# EAGLE design corex (EAGLE 6.6.0)

## Sheet 1 of 3
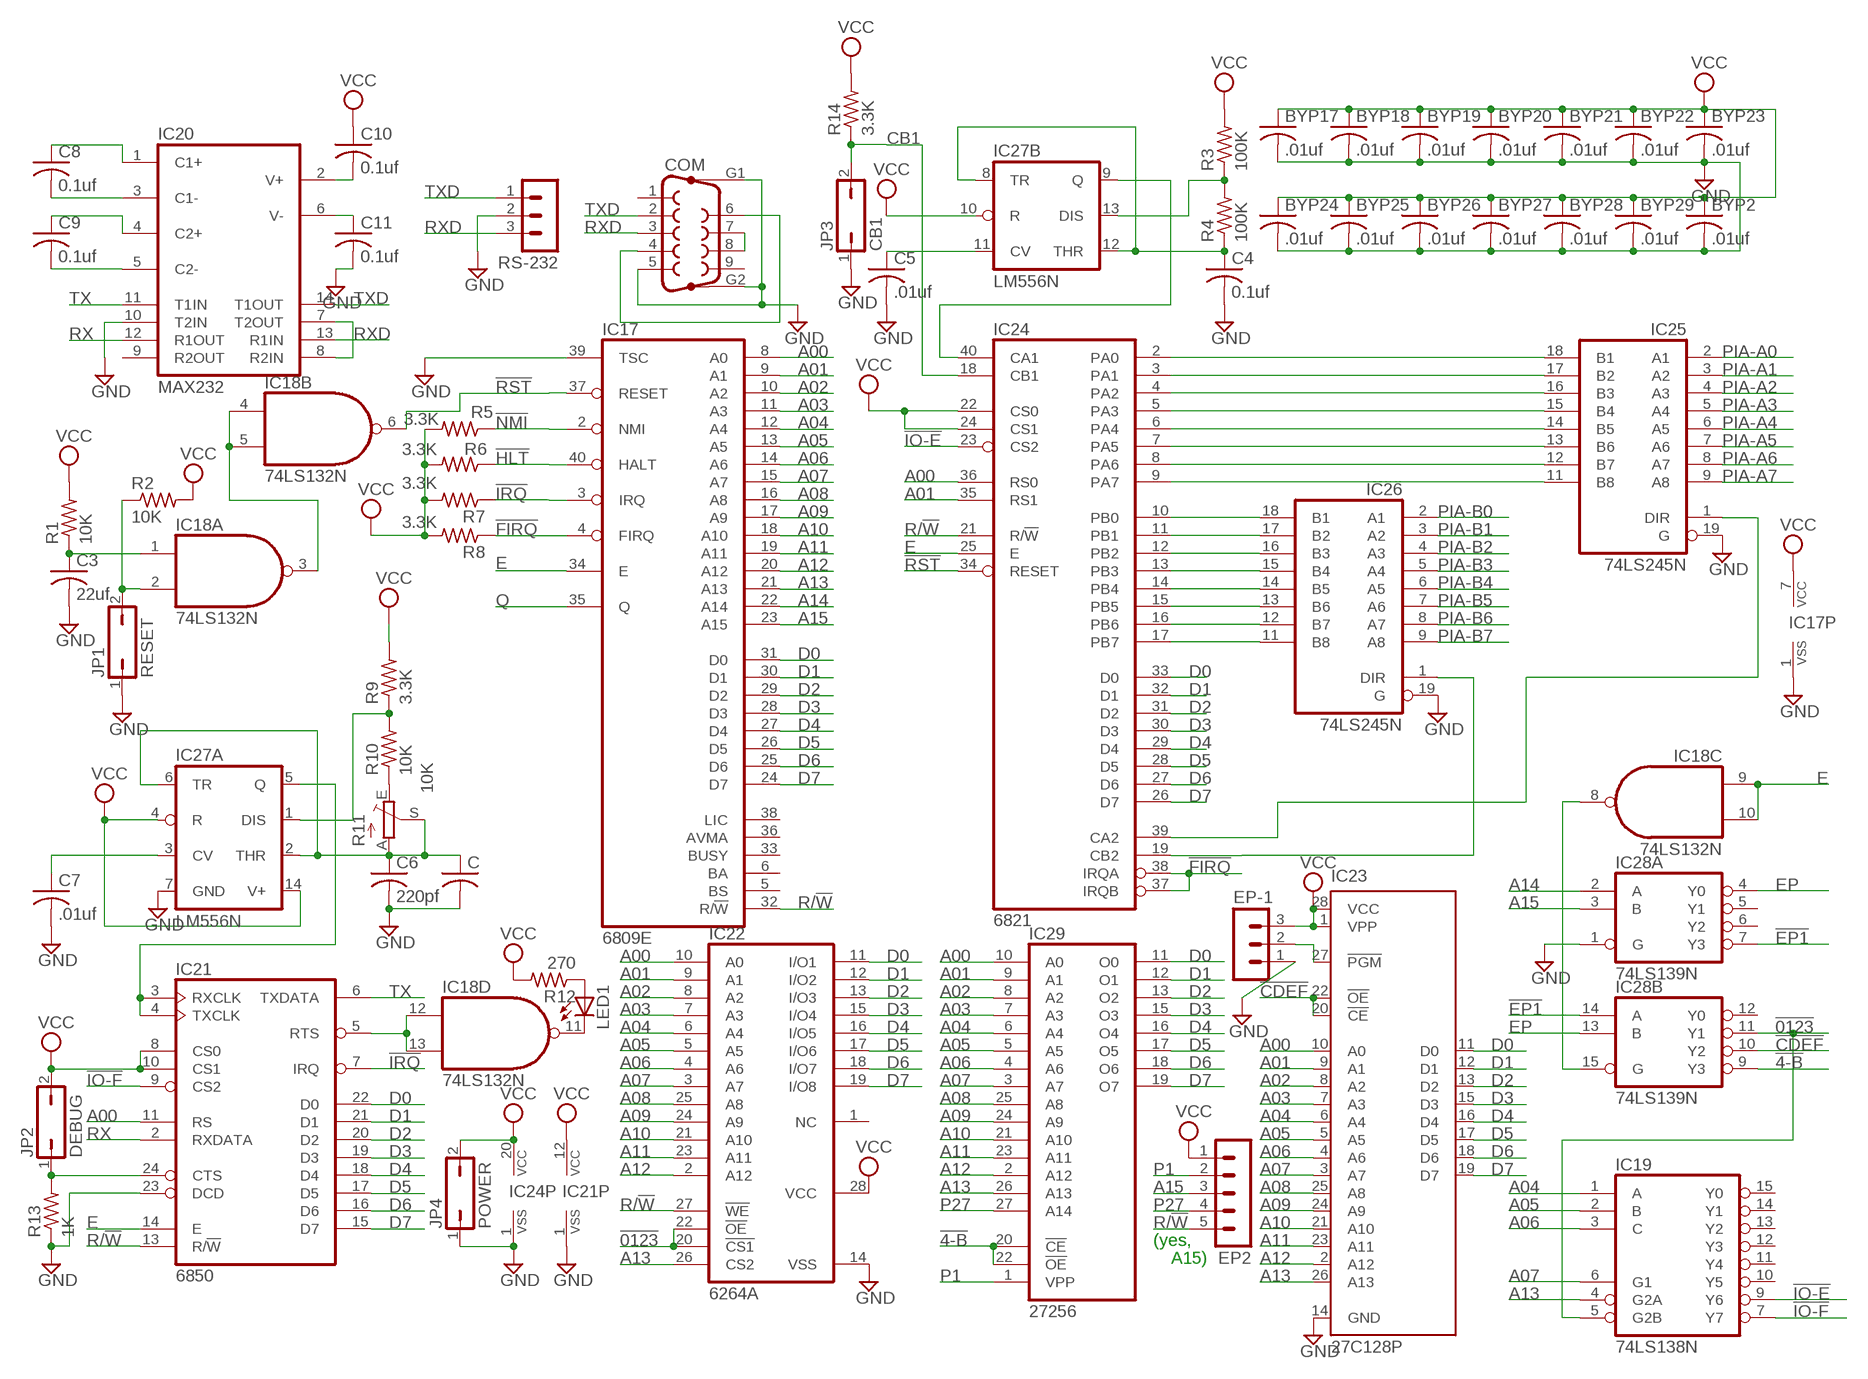
[diagram p0: schematic, sheet 1]

### Parts
BYP2  .01uf  C-US050-025X075  [C050-025X075]
BYP17  .01uf  C-US050-025X075  [C050-025X075]
BYP18  .01uf  C-US050-025X075  [C050-025X075]
BYP19  .01uf  C-US050-025X075  [C050-025X075]
BYP20  .01uf  C-US050-025X075  [C050-025X075]
BYP21  .01uf  C-US050-025X075  [C050-025X075]
BYP22  .01uf  C-US050-025X075  [C050-025X075]
BYP23  .01uf  C-US050-025X075  [C050-025X075]
BYP24  .01uf  C-US050-025X075  [C050-025X075]
BYP25  .01uf  C-US050-025X075  [C050-025X075]
BYP26  .01uf  C-US050-025X075  [C050-025X075]
BYP27  .01uf  C-US050-025X075  [C050-025X075]
BYP28  .01uf  C-US050-025X075  [C050-025X075]
BYP29  .01uf  C-US050-025X075  [C050-025X075]
C  C-US050-025X075  [C050-025X075]
C3  22uf  C-US102-054X133  [C102-054X133]
C4  0.1uf  C-US050-025X075  [C050-025X075]
C5  .01uf  C-US050-025X075  [C050-025X075]
C6  220pf  C-US050-025X075  [C050-025X075]
C7  .01uf  C-US050-025X075  [C050-025X075]
C8  0.1uf  C-US050-025X075  [C050-025X075]
C9  0.1uf  C-US050-025X075  [C050-025X075]
C10  0.1uf  C-US050-025X075  [C050-025X075]
C11  0.1uf  C-US050-025X075  [C050-025X075]
COM  F09HP  [F09HP]
EP2  MA05-1  [MA05-1]
EP-1  MA03-1  [MA03-1]
IC17  6809E  [DIL40]
IC18  74LS132N  74LS00N  [DIL14]
IC19  74LS138N  [DIL16]
IC20  MAX232  [DIL16]
IC21  6850  [DIL24]
IC22  6264A  [DIL28-6]
IC23  27C128P  [DIL28-6]
IC24  6821  [DIL40]
IC25  74LS245N  [DIL20]
IC26  74LS245N  [DIL20]
IC27  LM556N  [DIL14]
IC28  74LS139N  [DIL16]
IC29  27256  [DIL28]
JP1  RESET  JP1Q  [JP1]
JP2  DEBUG  JP1Q  [JP1]
JP3  CB1  JP1Q  [JP1]
JP4  POWER  JP1Q  [JP1]
LED1  LED3MM  [LED3MM]
R1  10K  R-US_0207/7  [0207/7]
R2  10K  R-US_0207/7  [0207/7]
R3  100K  R-US_0207/7  [0207/7]
R4  100K  R-US_0207/7  [0207/7]
R5  3.3K  R-US_0207/7  [0207/7]
R6  3.3K  R-US_0207/7  [0207/7]
R7  3.3K  R-US_0207/7  [0207/7]
R8  3.3K  R-US_0207/7  [0207/7]
R9  3.3K  R-US_0207/7  [0207/7]
R10  10K  R-US_0207/7  [0207/7]
R11  10K  TRIM_EU-B90P  [SP19L]
R12  270  R-US_0207/7  [0207/7]
R13  1K  R-US_0207/7  [0207/7]
R14  3.3K  R-US_0207/7  [0207/7]
RS-232  MA03-1  [MA03-1]

### Nets
!4-B: IC28.9(B:Y3) IC29.20(!CE) IC29.22(!OE)
!0123: IC19.5(G2B) IC22.20(!CS1) IC22.22(!OE) IC28.11(B:Y1)
!CDEF: IC23.20(!CE) IC23.22(!OE) IC28.10(B:Y2)
!EP1: IC28.7(A:Y3) IC28.14(B:A)
!FIRQ: IC17.4(FIRQ) IC24.37(IRQB) IC24.38(IRQA) R8.1
!HLT: IC17.40(HALT) R5.1
!IO-E: IC19.9(Y6) IC24.23(CS2)
!IO-F: IC19.7(Y7) IC21.9(CS2)
!IRQ: IC17.3(IRQ) IC21.7(IRQ) R7.1
!NMI: IC17.2(NMI) R6.1
!RST: IC17.37(RESET) IC18.6(B:O) IC24.34(RESET)
A00: IC17.8(A0) IC21.11(RS) IC22.10(A0) IC23.10(A0) IC24.36(RS0) IC29.10(A0)
A01: IC17.9(A1) IC22.9(A1) IC23.9(A1) IC24.35(RS1) IC29.9(A1)
A02: IC17.10(A2) IC22.8(A2) IC23.8(A2) IC29.8(A2)
A03: IC17.11(A3) IC22.7(A3) IC23.7(A3) IC29.7(A3)
A04: IC17.12(A4) IC19.1(A) IC22.6(A4) IC23.6(A4) IC29.6(A4)
A05: IC17.13(A5) IC19.2(B) IC22.5(A5) IC23.5(A5) IC29.5(A5)
A06: IC17.14(A6) IC19.3(C) IC22.4(A6) IC23.4(A6) IC29.4(A6)
A07: IC17.15(A7) IC19.6(G1) IC22.3(A7) IC23.3(A7) IC29.3(A7)
A08: IC17.16(A8) IC22.25(A8) IC23.25(A8) IC29.25(A8)
A09: IC17.17(A9) IC22.24(A9) IC23.24(A9) IC29.24(A9)
A10: IC17.18(A10) IC22.21(A10) IC23.21(A10) IC29.21(A10)
A11: IC17.19(A11) IC22.23(A11) IC23.23(A11) IC29.23(A11)
A12: IC17.20(A12) IC22.2(A12) IC23.2(A12) IC29.2(A12)
A13: IC17.21(A13) IC19.4(G2A) IC22.26(CS2) IC23.26(A13) IC29.26(A13)
A14: IC17.22(A14) IC28.2(A:A)
A15: EP2.3 IC17.23(A15) IC28.3(A:B)
CB1: IC24.18(CB1) JP3.2 R14.1
D0: IC17.31(D0) IC21.22(D0) IC22.11(I/O1) IC23.11(D0) IC24.33(D0) IC29.11(O0)
D1: IC17.30(D1) IC21.21(D1) IC22.12(I/O2) IC23.12(D1) IC24.32(D1) IC29.12(O1)
D2: IC17.29(D2) IC21.20(D2) IC22.13(I/O3) IC23.13(D2) IC24.31(D2) IC29.13(O2)
D3: IC17.28(D3) IC21.19(D3) IC22.15(I/O4) IC23.15(D3) IC24.30(D3) IC29.15(O3)
D4: IC17.27(D4) IC21.18(D4) IC22.16(I/O5) IC23.16(D4) IC24.29(D4) IC29.16(O4)
D5: IC17.26(D5) IC21.17(D5) IC22.17(I/O6) IC23.17(D5) IC24.28(D5) IC29.17(O5)
D6: IC17.25(D6) IC21.16(D6) IC22.18(I/O7) IC23.18(D6) IC24.27(D6) IC29.18(O6)
D7: IC17.24(D7) IC21.15(D7) IC22.19(I/O8) IC23.19(D7) IC24.26(D7) IC29.19(O7)
E: IC17.34(E) IC18.9(C:I0) IC18.10(C:I1) IC21.14(E) IC24.25(E) ; also sheet 3
EP: IC28.4(A:Y0) IC28.13(B:B)
GND [Power]: BYP2.2 BYP17.2 BYP18.2 BYP19.2 BYP20.2 BYP21.2 BYP22.2 BYP23.2 BYP24.2 BYP25.2 BYP26.2 BYP27.2 BYP28.2 BYP29.2 C3.2 C4.2 C5.2 C6.2 C7.2 C11.2 C.2 COM.5 COM.G1 COM.G2 EP-1.1 IC17.1(VSS) IC17.39(TSC) IC20.10(T2IN) IC21.1(VSS) IC21.23(DCD) IC22.14(VSS) IC23.14(GND) IC24.1(VSS) IC25.19(G) IC26.19(G) IC27.7(A:GND) IC28.1(A:G) JP1.1 JP3.1 JP4.1 R13.1 RS-232.2 ; also sheet 2,3
N$1: COM.4 COM.6
N$4: EP-1.2 IC23.27(!PGM)
N$5: IC24.2(PA0) IC25.18(B1)
N$6: IC18.3(A:O) IC18.4(B:I0) IC18.5(B:I1)
N$21: C3.1 IC18.1(A:I0) R1.1
N$22: IC18.2(A:I1) JP1.2 R2.1
N$23: IC21.3(RXCLK) IC21.4(TXCLK) IC27.5(A:Q)
N$24: IC24.10(PB0) IC26.18(B1)
N$25: IC24.11(PB1) IC26.17(B2)
N$27: C6.1 C.1 IC27.2(A:THR) IC27.6(A:TR) R11.A R11.S
N$28: IC27.1(A:DIS) R9.1 R10.2
N$94: IC24.12(PB2) IC26.16(B3)
N$124: IC24.13(PB3) IC26.15(B4)
N$125: IC24.14(PB4) IC26.14(B5)
N$126: IC24.15(PB5) IC26.13(B6)
N$127: IC24.16(PB6) IC26.12(B7)
N$128: IC24.17(PB7) IC26.11(B8)
N$129: IC24.3(PA1) IC25.17(B2)
N$130: IC24.4(PA2) IC25.16(B3)
N$131: IC24.5(PA3) IC25.15(B4)
N$132: IC24.6(PA4) IC25.14(B5)
N$133: IC24.7(PA5) IC25.13(B6)
N$134: IC24.8(PA6) IC25.12(B7)
N$135: IC24.9(PA7) IC25.11(B8)
N$136: IC24.19(CB2) IC26.1(DIR)
N$137: IC24.39(CA2) IC25.1(DIR)
N$138: IC24.40(CA1) IC27.9(B:Q)
N$140: C4.1 IC27.8(B:TR) IC27.12(B:THR) R4.1
N$141: IC27.13(B:DIS) R3.1 R4.2
N$142: C5.1 IC27.11(B:CV)
N$143: R10.1 R11.E
N$145: COM.7 COM.8
N$147: IC18.12(D:I0) IC18.13(D:I1) IC21.5(RTS)
N$148: IC18.11(D:O) LED1.K(C)
N$149: LED1.A R12.1
N$150: IC21.24(CTS) JP2.1 R13.2
N$151: IC18.8(C:O) IC28.15(B:G)
N$153: IC20.7(T2OUT) IC20.8(R2IN)
N$154: C7.1 IC27.3(A:CV)
N$155: C9.2 IC20.5(C2-)
N$156: C9.1 IC20.4(C2+)
N$157: C8.2 IC20.3(C1-)
N$158: C8.1 IC20.1(C1+)
N$159: C11.1 IC20.6(V-)
N$160: C10.2 IC20.2(V+)
P1: EP2.2 IC29.1(VPP)
P27: EP2.4 IC29.27(A14)
PIA-A0: IC25.2(A1) ; also sheet 2
PIA-A1: IC25.3(A2) ; also sheet 2
PIA-A2: IC25.4(A3) ; also sheet 2
PIA-A3: IC25.5(A4) ; also sheet 2
PIA-A4: IC25.6(A5) ; also sheet 2
PIA-A5: IC25.7(A6) ; also sheet 2
PIA-A6: IC25.8(A7) ; also sheet 2
PIA-A7: IC25.9(A8) ; also sheet 2
PIA-B0: IC26.2(A1) ; also sheet 2
PIA-B1: IC26.3(A2) ; also sheet 2
PIA-B2: IC26.4(A3) ; also sheet 2
PIA-B3: IC26.5(A4) ; also sheet 2
PIA-B4: IC26.6(A5) ; also sheet 2
PIA-B5: IC26.7(A6) ; also sheet 2
PIA-B6: IC26.8(A7) ; also sheet 2
PIA-B7: IC26.9(A8) ; also sheet 2
Q: IC17.35(Q) ; also sheet 3
R/!W: EP2.5 IC17.32(R/!W) IC21.13(R/!W) IC22.27(!WE) IC24.21(R/!W)
RX: IC20.12(R1OUT) IC21.2(RXDATA)
RXD: COM.3 IC20.13(R1IN) RS-232.3
TX: IC20.11(T1IN) IC21.6(TXDATA)
TXD: COM.2 IC20.14(T1OUT) RS-232.1
VCC [Power]: BYP2.1 BYP17.1 BYP18.1 BYP19.1 BYP20.1 BYP21.1 BYP22.1 BYP23.1 BYP24.1 BYP25.1 BYP26.1 BYP27.1 BYP28.1 BYP29.1 C10.1 EP2.1 EP-1.3 IC17.7(VCC) IC21.8(CS0) IC21.10(CS1) IC21.12(VCC) IC22.28(VCC) IC23.1(VPP) IC23.28(VCC) IC24.20(VCC) IC24.22(CS0) IC24.24(CS1) IC27.4(A:R) IC27.10(B:R) IC27.14(A:V+) JP2.2 JP4.2 R1.2 R2.2 R3.2 R5.2 R6.2 R7.2 R8.2 R9.2 R12.2 R14.2 ; also sheet 2,3
Unconnected: COM.1 COM.9 IC17.5(BS) IC17.6(BA) IC17.33(BUSY) IC17.36(AVMA) IC17.38(LIC) IC19.10(Y5) IC19.11(Y4) IC19.12(Y3) IC19.13(Y2) IC19.14(Y1) IC19.15(Y0) IC20.9(R2OUT) IC22.1(NC) IC28.5(A:Y1) IC28.6(A:Y2) IC28.12(B:Y0)

### Notes on the sheet
- (yes,
- A15)

## Sheet 2 of 3
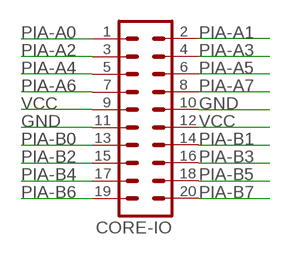
[diagram p1: schematic, sheet 2]

### Parts
CORE-IO  MA10-2  [MA10-2]

### Nets
GND [Power]: CORE-IO.10 CORE-IO.11 ; also sheet 1,3
PIA-A0: CORE-IO.1 ; also sheet 1
PIA-A1: CORE-IO.2 ; also sheet 1
PIA-A2: CORE-IO.3 ; also sheet 1
PIA-A3: CORE-IO.4 ; also sheet 1
PIA-A4: CORE-IO.5 ; also sheet 1
PIA-A5: CORE-IO.6 ; also sheet 1
PIA-A6: CORE-IO.7 ; also sheet 1
PIA-A7: CORE-IO.8 ; also sheet 1
PIA-B0: CORE-IO.13 ; also sheet 1
PIA-B1: CORE-IO.14 ; also sheet 1
PIA-B2: CORE-IO.15 ; also sheet 1
PIA-B3: CORE-IO.16 ; also sheet 1
PIA-B4: CORE-IO.17 ; also sheet 1
PIA-B5: CORE-IO.18 ; also sheet 1
PIA-B6: CORE-IO.19 ; also sheet 1
PIA-B7: CORE-IO.20 ; also sheet 1
VCC [Power]: CORE-IO.9 CORE-IO.12 ; also sheet 1,3

## Sheet 3 of 3
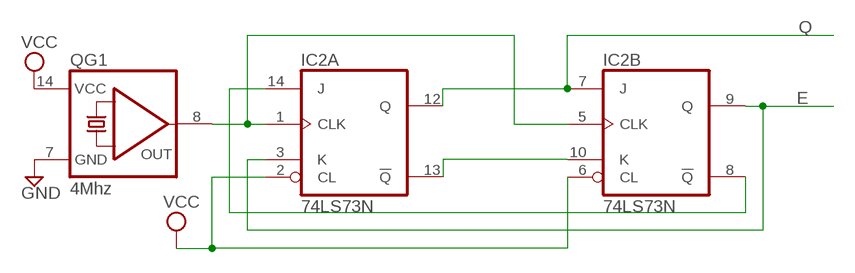
[diagram p2: schematic, sheet 3]

### Parts
IC2  74LS73N  [DIL14]
QG1  4Mhz  QG5860  [DIL14S]

### Nets
E: IC2.3(A:K) IC2.9(B:Q) ; also sheet 1
GND [Power]: QG1.7(GND) ; also sheet 1,2
N$2: IC2.1(A:CLK) IC2.5(B:CLK) QG1.8(OUT)
N$3: IC2.10(B:K) IC2.13(A:!Q)
N$7: IC2.8(B:!Q) IC2.14(A:J)
Q: IC2.7(B:J) IC2.12(A:Q) ; also sheet 1
VCC [Power]: IC2.2(A:CL) IC2.6(B:CL) QG1.14(VCC) ; also sheet 1,2

## Power pins joined to a net without a drawn wire
GND: IC2.11(P:GND) IC18.7(P:GND) IC19.8(GND) IC20.15(GND) IC25.10(GND) IC26.10(GND) IC28.8(P:GND) IC29.14(GND)
VCC: IC2.4(P:VCC) IC18.14(P:VCC) IC19.16(VCC) IC20.16(VCC) IC25.20(VCC) IC26.20(VCC) IC28.16(P:VCC) IC29.28(VCC)

## Library data of the parts
BYP2 BYP17-BYP29 C C3-C11 = rcl:C-US: CAPACITOR, American symbol
COM = con-subd:F09HP: SUB-D; OC_FARNELL: unknown; OC_NEWARK: unknown
CORE-IO = con-lstb:MA10-2: PIN HEADER; OC_FARNELL: unknown; OC_NEWARK: unknown
EP2 = con-lstb:MA05-1: PIN HEADER; OC_FARNELL: unknown; OC_NEWARK: unknown
EP-1 RS-232 = con-lstb:MA03-1: PIN HEADER; OC_FARNELL: unknown; OC_NEWARK: unknown
IC2 = 74xx-us:74*73: Dual J-K FLIP FLOP, clear
IC17 = micro-motorola:6809E: MICROCONTROLLER/MEMORY DEVICE; MF: NTE ELECTRONICS; MPN: NTE6809E; OC_FARNELL: unknown; OC_NEWARK: 31C5318
IC18 = 74xx-us:74*00: Quad 2-input NAND gate
IC19 = 74xx-us:74*138: 3-line to 8-line DECODER/DEMULTIPLEXER
IC20 = maxim:MAX232: RS232 TRANSCEIVER; MF: MAXIM; MPN: MAX232ACPE+; OC_FARNELL: 9723773; OC_NEWARK: 68K4544
IC21 = micro-motorola:6850: MICROCONTROLLER/MEMORY DEVICE; MF: NTE ELECTRONICS; MPN: NTE6850; OC_FARNELL: 4899775; OC_NEWARK: 31C2457
IC22 = memory-hitachi:6264A: MEMORY; OC_FARNELL: 283605; OC_NEWARK: unknown
IC23 = microchip:27*128: CMOS EPROM 128 K (16 K x 8); OC_FARNELL: unknown; OC_NEWARK: unknown
IC24 = micro-motorola:6821: MICROCONTROLLER/MEMORY DEVICE; MF: NTE ELECTRONICS; MPN: NTE6821; OC_FARNELL: 1652403; OC_NEWARK: 29C4772
IC25 IC26 = 74xx-us:74*245: Octal BUS TRANSCEIVER, 3-state
IC27 = linear:*556: Dual TIMER
IC28 = 74xx-us:74*139: Dual 2-line to 4-line DECODER/DEMULTIPLEXER
IC29 = memory:27256: MEMORY
JP1-JP4 = jumper:JP1Q: JUMPER
LED1 = led:LED: LED OSRAM: - CHIPLED LG R971, LG N971, LY N971, LG Q971, LY Q971, LO R971, LY R971 LH N974, LH R974 LS Q976, LO Q976, LY Q976 LO Q996 - Hyper CHIPLED LW Q18S LB Q993, LB Q99A, LB R99A - SideLED LS A670, LO A670, LY A670, LG A670, LP A670 LB A673, LV A673, LT A673, LW A673 LH A674 LY A675 LS A676, LA A676, LO A676, LY A676, LW A676 LS A679, LY A679, LG A679 - Hyper Micro SIDELED® LS Y876, LA Y876, LO Y876, LY Y876 LT Y87S - SmartLED LW L88C, LW L88S LB L89C, LB L89S, LG L890 LS L89K, LO L89K, LY L89K LS L896, LA L896, LO L896, LY L896 - TOPLED LS T670, LO T670, LY T670, LG T670, LP T670 LSG T670, LSP T670, LSY T670, LOP T670, LYG T670 LG T671, LOG T671, LSG T671 LB T673, LV T673, LT T673, LW T673 LH T674 LS T676, LA T676, LO T676, LY T676, LB T676, LH T676, LSB T676, LW T676 LB T67C, LV T67C, LT T67C, LS T67K, LO T67K, LY T67K, LW E67C LS E67B, LA E67B, LO E67B, LY E67B, LB E67C, LV E67C, LT E67C LW T67C LS T679, LY T679, LG T679 LS T770, LO T770, LY T770, LG T770, LP T770 LB T773, LV T773, LT T773, LW T773 LH T774 LS E675, LA E675, LY E675, LS T675 LS T776, LA T776, LO T776, LY T776, LB T776 LHGB T686 LT T68C, LB T68C - Hyper Mini TOPLED® LB M676 - Mini TOPLED Santana® LG M470 LS M47K, LO M47K, LY M47K Source: http://www.osram.convergy.de LUXEON: - LUMILED® LXK2-PW12-R00, LXK2-PW12-S00, LXK2-PW14-U00, LXK2-PW14-V00 LXK2-PM12-R00, LXK2-PM12-S00, LXK2-PM14-U00 LXK2-PE12-Q00, LXK2-PE12-R00, LXK2-PE12-S00, LXK2-PE14-T00, LXK2-PE14-U00 LXK2-PB12-K00, LXK2-PB12-L00, LXK2-PB12-M00, LXK2-PB14-N00, LXK2-PB14-P00, LXK2-PB14-Q00 LXK2-PR12-L00, LXK2-PR12-M00, LXK2-PR14-Q00, LXK2-PR14-R00 LXK2-PD12-Q00, LXK2-PD12-R00, LXK2-PD12-S00 LXK2-PH12-R00, LXK2-PH12-S00 LXK2-PL12-P00, LXK2-PL12-Q00, LXK2-PL12-R00 Source: www.luxeon.com KINGBRIGHT: KA-3528ASYC Source: www.kingbright.com
QG1 = crystal:QG5860: CRYSTAL RESONATOR; OC_FARNELL: unknown; OC_NEWARK: unknown
R1-R10 R12-R14 = rcl:R-US_: RESISTOR, American symbol
R11 = pot:TRIM_EU-: POTENTIOMETER

## Net classes
1 Power: width 0.508 mm, drill 0.254 mm, clearance 0.254 mm

## Board
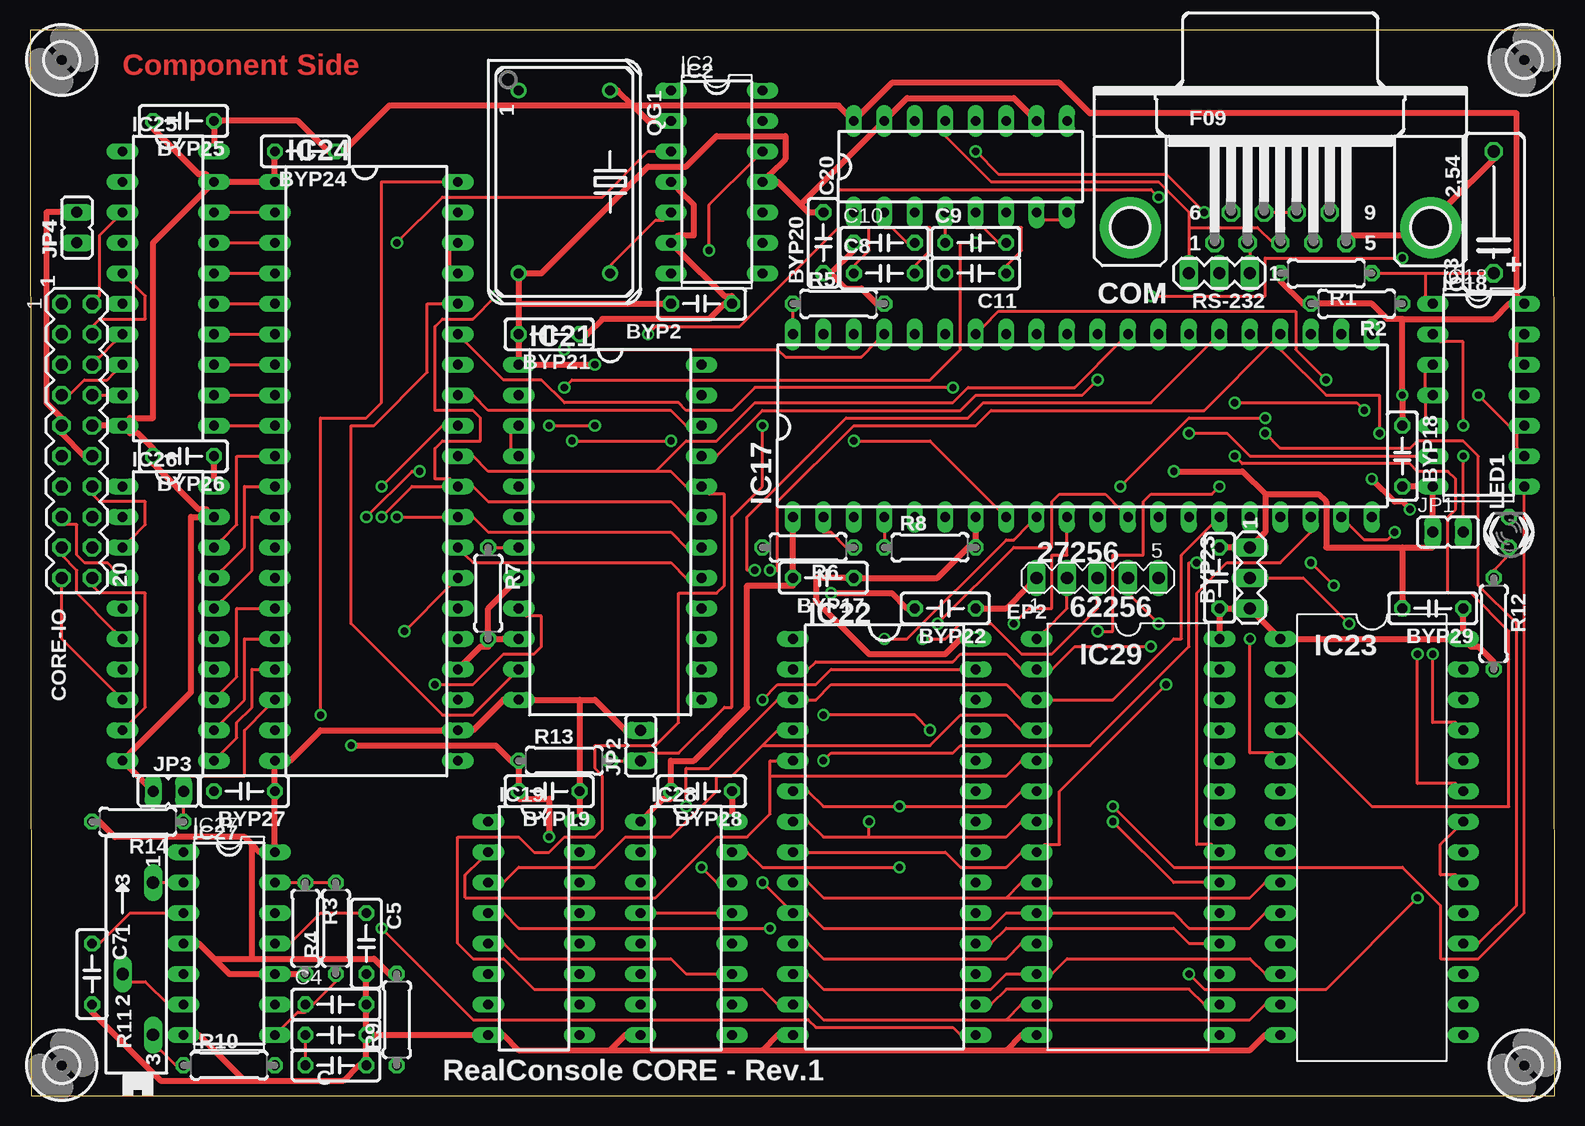
[diagram p3: board, top side]
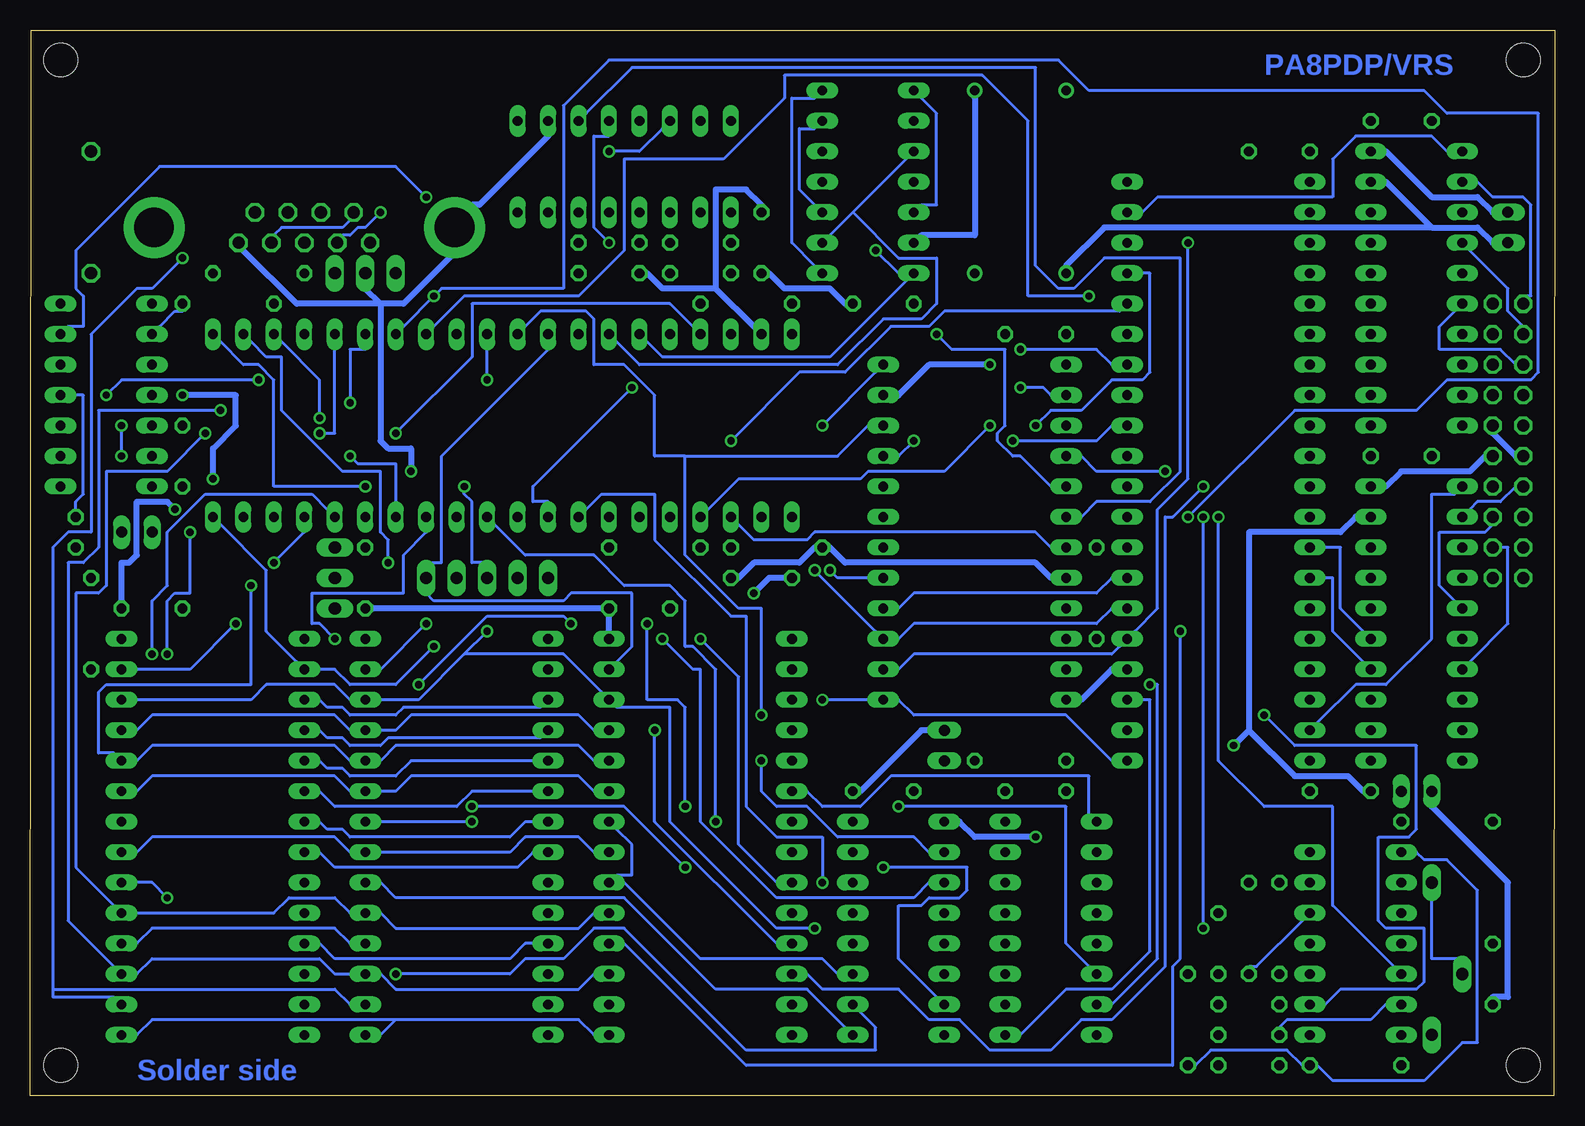
[diagram p4: board, bottom side, seen from below]

Size 127.11 x 88.87 mm. Coordinates in mm from the lower left corner, seen from the top.
Outline: 0.1,0 127.11,0 127.01,88.87 0,88.87 0.1,0
Copper layers (1*16): Top 0.035mm / dielectric 1.5mm / Bottom 0.035mm
Design rules "olimex10mil": minimum track width 10mil, minimum drill 24mil, track to track 10mil, track to pad 10mil, pad to pad 10mil, via to via 10mil, smd to smd 10mil, copper to edge 40mil, drill to drill 10mil, minimum pad ring 10mil, minimum via ring 8mil, stop-mask expansion 0mil, vias tented up to drill 0mil, thermal gap 10mil

### Footprints (pad centres in the part's own frame; a part is rotated, then mirrored left to right if it is on the bottom)
C050-025X075 = drill 0.813 octagon: 1 -2.54,0; 2 2.54,0
C102-054X133 = drill 1.016 octagon: 1 -5.08,0; 2 5.08,0
F09HP = drill 1.016 octagon: 1 -5.486,-1.27; 2 -2.743,-1.27; 3 0,-1.27; 4 2.743,-1.27; 5 5.486,-1.27; 6 -4.115,1.27; 7 -1.372,1.27; 8 1.372,1.27; 9 4.115,1.27 | drill 3.302 pad 5.08: G1 -12.522,0; G2 12.522,0
MA10-2 = drill 1.016 octagon: 1 -11.43,-1.27; 2 -11.43,1.27; 3 -8.89,-1.27; 4 -8.89,1.27; 5 -6.35,-1.27; 6 -6.35,1.27; 7 -3.81,-1.27; 8 -3.81,1.27; 9 -1.27,-1.27; 10 -1.27,1.27; 11 1.27,-1.27; 12 1.27,1.27; 13 3.81,-1.27; 14 3.81,1.27; 15 6.35,-1.27; 16 6.35,1.27; 17 8.89,-1.27; 18 8.89,1.27; 19 11.43,-1.27; 20 11.43,1.27
MA05-1 = drill 1.016 long: 1 -5.08,0; 2 -2.54,0; 3 0,0; 4 2.54,0; 5 5.08,0
MA03-1 = drill 1.016 long: 1 -2.54,0; 2 0,0; 3 2.54,0
DIL14 = drill 0.813 long: 1 -7.62,-3.81; 2 -5.08,-3.81; 3 -2.54,-3.81; 4 0,-3.81; 5 2.54,-3.81; 6 5.08,-3.81; 7 7.62,-3.81; 8 7.62,3.81; 9 5.08,3.81; 10 2.54,3.81; 11 0,3.81; 12 -2.54,3.81; 13 -5.08,3.81; 14 -7.62,3.81
DIL40 = drill 0.813 long: 1 -24.13,-7.62; 2 -21.59,-7.62; 3 -19.05,-7.62; 4 -16.51,-7.62; 5 -13.97,-7.62; 6 -11.43,-7.62; 7 -8.89,-7.62; 8 -6.35,-7.62; 9 -3.81,-7.62; 10 -1.27,-7.62; 11 1.27,-7.62; 12 3.81,-7.62; 13 6.35,-7.62; 14 8.89,-7.62; 15 11.43,-7.62; 16 13.97,-7.62; 17 16.51,-7.62; 18 19.05,-7.62; 19 21.59,-7.62; 20 24.13,-7.62; 21 24.13,7.62; 22 21.59,7.62; 23 19.05,7.62; 24 16.51,7.62; 25 13.97,7.62; 26 11.43,7.62; 27 8.89,7.62; 28 6.35,7.62; 29 3.81,7.62; 30 1.27,7.62; 31 -1.27,7.62; 32 -3.81,7.62; 33 -6.35,7.62; 34 -8.89,7.62; 35 -11.43,7.62; 36 -13.97,7.62; 37 -16.51,7.62; 38 -19.05,7.62; 39 -21.59,7.62; 40 -24.13,7.62
DIL16 = drill 0.813 long: 1 -8.89,-3.81; 2 -6.35,-3.81; 3 -3.81,-3.81; 4 -1.27,-3.81; 5 1.27,-3.81; 6 3.81,-3.81; 7 6.35,-3.81; 8 8.89,-3.81; 9 8.89,3.81; 10 6.35,3.81; 11 3.81,3.81; 12 1.27,3.81; 13 -1.27,3.81; 14 -3.81,3.81; 15 -6.35,3.81; 16 -8.89,3.81
DIL24 = drill 0.813 long: 1 -13.97,-7.62; 2 -11.43,-7.62; 3 -8.89,-7.62; 4 -6.35,-7.62; 5 -3.81,-7.62; 6 -1.27,-7.62; 7 1.27,-7.62; 8 3.81,-7.62; 9 6.35,-7.62; 10 8.89,-7.62; 11 11.43,-7.62; 12 13.97,-7.62; 13 13.97,7.62; 14 11.43,7.62; 15 8.89,7.62; 16 6.35,7.62; 17 3.81,7.62; 18 1.27,7.62; 19 -1.27,7.62; 20 -3.81,7.62; 21 -6.35,7.62; 22 -8.89,7.62; 23 -11.43,7.62; 24 -13.97,7.62
DIL28-6 = drill 0.813 long: 1 -16.51,-7.62; 2 -13.97,-7.62; 3 -11.43,-7.62; 4 -8.89,-7.62; 5 -6.35,-7.62; 6 -3.81,-7.62; 7 -1.27,-7.62; 8 1.27,-7.62; 9 3.81,-7.62; 10 6.35,-7.62; 11 8.89,-7.62; 12 11.43,-7.62; 13 13.97,-7.62; 14 16.51,-7.62; 15 16.51,7.62; 16 13.97,7.62; 17 11.43,7.62; 18 8.89,7.62; 19 6.35,7.62; 20 3.81,7.62; 21 1.27,7.62; 22 -1.27,7.62; 23 -3.81,7.62; 24 -6.35,7.62; 25 -8.89,7.62; 26 -11.43,7.62; 27 -13.97,7.62; 28 -16.51,7.62
DIL20 = drill 0.813 long: 1 -11.43,-3.81; 2 -8.89,-3.81; 3 -6.35,-3.81; 4 -3.81,-3.81; 5 -1.27,-3.81; 6 1.27,-3.81; 7 3.81,-3.81; 8 6.35,-3.81; 9 8.89,-3.81; 10 11.43,-3.81; 11 11.43,3.81; 12 8.89,3.81; 13 6.35,3.81; 14 3.81,3.81; 15 1.27,3.81; 16 -1.27,3.81; 17 -3.81,3.81; 18 -6.35,3.81; 19 -8.89,3.81; 20 -11.43,3.81
DIL28 = drill 0.813 long: 1 -16.51,-7.62; 2 -13.97,-7.62; 3 -11.43,-7.62; 4 -8.89,-7.62; 5 -6.35,-7.62; 6 -3.81,-7.62; 7 -1.27,-7.62; 8 1.27,-7.62; 9 3.81,-7.62; 10 6.35,-7.62; 11 8.89,-7.62; 12 11.43,-7.62; 13 13.97,-7.62; 14 16.51,-7.62; 15 16.51,7.62; 16 13.97,7.62; 17 11.43,7.62; 18 8.89,7.62; 19 6.35,7.62; 20 3.81,7.62; 21 1.27,7.62; 22 -1.27,7.62; 23 -3.81,7.62; 24 -6.35,7.62; 25 -8.89,7.62; 26 -11.43,7.62; 27 -13.97,7.62; 28 -16.51,7.62
JP1 = drill 0.914 long: 1 0,-1.27; 2 0,1.27
LED3MM = drill 0.813 octagon: A -1.27,0; K 1.27,0
DIL14S = drill 0.813: 1 -7.62,-3.81; 7 7.62,-3.81; 8 7.62,3.81; 14 -7.62,3.81
0207/7 = drill 0.813 octagon: 1 -3.81,0; 2 3.81,0
SP19L = drill 1.016 long: A 5.715,-1.27; E -6.985,-1.27; S -1.905,1.27
2,8 = hole 2.8: 0,0

### Placement (x,y rotation side)
BYP2  55.98,66.05 180 top
BYP17  66.14,43.19 180 top
BYP18  114.4,53.35 270 top
BYP19  43.28,25.41 180 top
BYP20  66.14,71.13 90 top
BYP21  43.28,63.51 180 top
BYP22  76.3,40.65 180 top
BYP23  99.16,43.19 90 top
BYP24  22.96,78.75 180 top
BYP25  12.8,81.29 180 top
BYP26  12.8,53.35 180 top
BYP27  17.88,25.41 180 top
BYP28  55.98,25.41 180 top
BYP29  116.94,40.65 180 top
C  25.5,2.55 0 top
C3  122.02,73.67 90 top
C4  25.5,7.63 0 top
C5  28.04,12.71 270 top
C6  25.5,5.09 0 top
C7  5.18,10.17 270 top
C8  71.22,68.59 0 top
C9  78.84,71.13 0 top
C10  71.22,71.13 0 top
C11  78.84,68.59 180 top
COM  104.24,72.4 0 top
CORE-IO  3.91,54.62 270 top
EP2  89,43.19 0 top
EP-1  101.7,43.19 270 top
IC2  57.25,76.21 270 top
IC17  87.73,55.89 0 top
IC18  120.75,58.43 270 top
IC19  42.01,13.98 270 top
IC20  77.57,77.48 0 top
IC21  48.36,47 270 top
IC22  71.22,21.6 270 top
IC23  111.86,21.6 270 top
IC24  28.04,52.08 270 top
IC25  11.53,67.32 270 top
IC26  11.53,39.38 270 top
IC27  16.61,12.71 270 top
IC28  54.71,13.98 270 top
IC29  91.54,21.6 270 top
JP1  118.21,47 270 top
JP2  50.9,29.22 0 top
JP3  11.53,25.41 270 top
JP4  3.91,72.4 0 top
LED1  123.29,47 90 top
QG1  44.55,76.21 270 top
R1  108.05,68.59 180 top
R2  110.59,66.05 180 top
R3  22.96,13.98 270 top
R4  25.5,13.98 90 top
R5  67.41,66.05 0 top
R6  64.87,45.73 180 top
R7  38.2,41.92 270 top
R8  75.03,45.73 0 top
R9  30.58,6.36 90 top
R10  16.61,2.55 0 top
R11  8.99,12.08 90 top
R12  122.02,39.38 270 top
R13  44.55,27.95 0 top
R14  8.99,22.87 180 top
RS-232  99.16,68.59 180 top
U$3  [2,8]  2.64,86.37 0 top
U$4  [2,8]  2.64,2.55 0 top
U$5  [2,8]  124.56,86.37 0 top
U$6  [2,8]  124.56,2.55 0 top

### Tracks (layer width: path | path; a pad name or v marks a point on that pad's centre or on a via)
!4-B  (via drill 0.61)
  Top 0.254: v90.27,22.87 95.35,17.79 97.89,17.79 IC29.20
  Bottom 0.254: IC28.9 59.15,5.73 62.33,8.9 69.95,8.9 77.57,16.52 96.62,16.52 97.89,17.79 IC29.20 | v90.27,22.87 97.89,22.87 IC29.22
!0123
  Top 0.254: IC19.5 39.47,12.71 40.74,11.44 53.44,11.44 54.71,10.17 57.25,10.17 IC28.11
  Bottom 0.254: IC28.11 59.79,10.17 61.06,11.44 71.22,11.44 77.57,17.79 IC22.20 78.2,18.43 76.93,18.43 76.93,20.97 78.2,22.24 IC22.22
!CDEF  (via drill 0.61)
  Top 0.254: v96.62,10.17 97.89,8.9 108.05,8.9 v115.67,16.52 | IC23.22 118.84,22.24 117.57,20.97 117.57,18.43 118.84,18.43 IC23.20
  Bottom 0.254: v96.62,10.17 87.09,10.17 85.82,11.44 82.65,11.44 80.11,13.98 77.57,13.98 67.41,3.82 56.61,3.82 56.61,5.73 57.88,7 IC28.10 | v115.67,16.52 116.94,17.79 118.21,17.79 IC23.20
!EP1  (via drill 0.61)
  Top 0.254: v55.98,19.06 57.25,17.79 IC28.14
  Bottom 0.254: v55.98,19.06 48.99,19.06 48.99,17.16 49.63,16.52 52.17,16.52 52.8,15.89 54.71,15.89 54.71,11.44 51.53,8.27 IC28.7
!FIRQ  (via drill 0.61)
  Top 0.254: R8.1 71.22,46.37 71.22,47 IC17.4 | IC24.37 35.02,69.23 35.02,70.5 IC24.38 | v43.28,55.89 v47.09,55.89
  Bottom 0.254: v47.09,55.89 50.9,52.08 57.25,52.08 57.88,51.45 68.04,51.45 70.58,48.91 IC17.4 | v43.28,55.89 42.01,57.16 39.47,57.16 36.93,59.7 34.39,59.7 33.75,60.34 33.75,68.59 34.39,68.59 IC24.37
!HLT
  Top 0.254: IC17.40 63.6,64.78 63.6,65.42 R5.1
!IO-E
  Bottom 0.254: IC19.9 44.55,5.09 40.74,8.9 36.93,8.9 33.75,12.08 33.75,33.03 34.39,33.03 IC24.23
!IO-F  (via drill 0.61)
  Top 0.254: v33.75,34.3 36.93,34.3 39.47,36.84 42.01,36.84 42.64,37.48 42.64,40.02 41.37,40.02 IC21.9
  Bottom 0.254: v33.75,34.3 33.12,34.3 33.12,11.44 36.93,7.63 IC19.7
!IRQ
  Top 0.254: R7.1 38.83,45.73 39.47,45.73 IC21.7
  Bottom 0.254: IC17.3 68.04,47.64 66.77,46.37 62.33,46.37 61.69,47 43.28,47 42.01,45.73 IC21.7
!NMI
  Top 0.254: R6.1 68.04,45.73 66.77,47 66.14,47 IC17.2
!RST  (via drill 0.61)
  Top 0.254: v44.55,62.24 62.33,62.24 62.96,61.61 69.31,61.61 70.58,62.88 IC17.37 | v96.62,55.26 99.79,55.26 101.7,53.35 115.67,53.35 IC18.6
  Bottom 0.254: v44.55,62.24 38.2,62.24 36.93,60.97 IC24.34 | v96.62,55.26 90.27,61.61 90.27,66.05 73.76,66.05 71.85,64.15 IC17.37
A00  (via drill 0.61)
  Top 0.254: IC23.10 102.97,15.25 101.7,13.98 96.62,13.98 95.35,15.25 85.19,15.25 IC29.10 82.65,15.25 81.38,15.25 80.11,13.98 66.14,13.98 64.87,15.25 IC22.10 62.96,15.89 v61.06,17.79 | IC21.11 40.1,34.94 36.93,31.76 34.39,31.76 26.77,39.38 26.77,55.89 28.67,55.89 33.12,60.34 33.12,66.05 34.39,66.05 IC24.36 | v68.68,54.62 75.03,54.62 80.74,48.91 IC17.8
  Bottom 0.254: v68.68,54.62 62.96,60.34 59.15,60.34 55.34,64.15 52.17,64.15 50.9,65.42 36.29,65.42 IC24.36 | v61.06,17.79 61.06,21.6 64.87,21.6 67.41,24.14 67.41,40.02 68.68,40.02 75.03,46.37 75.03,50.18 79.47,50.18 80.74,48.91 IC17.8
A01  (via drill 0.61)
  Top 0.254: 81.38,16.52 66.14,16.52 64.87,17.79 IC22.9 | 81.38,16.52 82.65,17.79 IC29.9 | v71.22,38.11 73.12,38.11 81.38,46.37 82.01,46.37 83.28,47.64 IC17.9 | 81.38,16.52 101.7,16.52 102.97,17.79 IC23.9 | v76.93,59.07 60.42,59.07 58.52,57.16 54.71,57.16 54.07,57.8 44.55,57.8 42.64,59.7 39.47,59.7 36.29,62.88 IC24.35
  Bottom 0.254: v71.22,38.11 68.04,34.94 68.04,20.97 64.87,17.79 IC22.9 | v76.93,59.07 85.19,50.81 85.19,49.54 83.92,49.54 IC17.9
A02  (via drill 0.61)
  Top 0.254: IC22.8 64.87,20.33 76.3,20.33 77.57,19.06 81.38,19.06 82.65,20.33 IC29.8 84.55,20.97 85.82,20.97 85.82,25.41 v94.71,34.3 | v82.01,39.38 83.28,40.65 85.19,40.65 85.19,45.1 86.46,45.1 86.46,47 IC17.10
  Bottom 0.254: IC23.8 102.97,20.33 101.7,19.06 86.46,19.06 85.19,20.33 IC29.8 | v82.01,39.38 82.65,40.02 89,40.02 v94.71,34.3
A03  (via drill 0.61)
  Top 0.254: 69.95,21.6 81.38,21.6 82.65,22.87 IC29.7 | 69.95,21.6 66.14,21.6 64.87,22.87 IC22.7 | 69.95,21.6 v69.95,22.87
  Bottom 0.254: v69.95,22.87 69.95,35.57 71.85,37.48 72.49,37.48 72.49,41.29 73.76,42.56 77.57,42.56 80.11,45.1 85.82,45.1 88.36,47.64 IC17.11 | IC23.7 102.97,22.87 102.33,22.24 101.06,22.24 100.43,21.6 87.09,21.6 85.82,22.87 85.19,22.87 IC29.7
A04  (via drill 0.61)
  Top 0.254: IC29.6 82.65,25.41 81.38,24.14 v72.49,24.14 66.14,24.14 64.87,25.41 IC22.6 | v75.66,39.38 82.01,45.73 85.19,45.73 85.19,49.54 85.82,50.18 89.63,50.18 90.9,48.91 IC17.12
  Bottom 0.254: IC19.1 38.83,23.51 38.83,26.68 55.34,26.68 57.88,24.14 61.06,24.14 62.33,25.41 IC22.6 | v75.66,39.38 75.66,33.03 73.12,33.03 72.49,32.4 v72.49,24.14 | IC23.6 102.97,25.41 101.7,24.14 91.54,24.14 90.27,25.41 85.19,25.41 IC29.6
A05  (via drill 0.61)
  Top 0.254: 61.69,26.68 61.69,27.95 62.33,27.95 IC22.5 | 61.69,26.68 61.69,23.51 59.79,21.6 57.25,21.6 52.17,16.52 36.29,16.52 36.29,18.43 37.56,19.7 IC19.2 | 61.69,26.68 81.38,26.68 82.65,27.95 IC29.5 | v101.7,38.11 101.7,28.59 103.6,28.59 IC23.5
  Bottom 0.254: IC23.5 102.97,27.95 102.33,27.32 101.06,27.32 100.43,26.68 96.62,26.68 95.35,27.95 85.19,27.95 IC29.5 | v101.7,38.11 102.97,39.38 103.6,39.38 103.6,41.92 95.98,41.92 95.98,45.1 94.08,47 IC17.13
A06  (via drill 0.61)
  Top 0.254: v100.43,53.35 101.06,52.72 115.03,52.72 115.67,52.08 118.21,52.08 118.84,51.45 118.84,48.91 118.21,48.27 118.21,41.92 120.11,41.92 123.29,38.75 123.29,24.14 111.86,24.14 105.51,30.49 IC23.4 | 61.06,29.22 62.33,30.49 IC22.4 | 61.06,29.22 58.52,26.68 57.25,26.68 57.25,25.41 53.44,21.6 49.63,21.6 47.09,19.06 40.74,19.06 39.47,17.79 IC19.3 | 61.06,29.22 75.03,29.22 77.57,31.76 81.38,31.76 82.65,30.49 IC29.4
  Bottom 0.254: v100.43,53.35 99.79,52.72 96.62,52.72 96.62,49.54 IC17.14 | IC23.4 102.97,30.49 102.33,29.86 101.06,29.86 100.43,29.22 97.89,29.22 97.25,29.86 84.55,29.86 IC29.4
A07  (via drill 0.61)
  Top 0.254: v54.71,24.14 54.71,27.32 56.61,27.32 62.33,33.03 IC22.3 64.87,33.03 65.5,33.03 66.77,34.3 81.38,34.3 82.65,33.03 IC29.3 85.19,33.03 90.27,33.03 95.35,38.11 95.98,38.11 95.98,45.1 98.52,47.64 IC17.15
  Bottom 0.254: v54.71,24.14 40.74,24.14 40.74,12.71 38.83,10.81 IC19.6 | IC23.3 102.97,33.03 102.33,32.4 101.06,32.4 100.43,31.76 96.62,31.76 95.98,32.4 84.55,32.4 IC29.3
A08  (via drill 0.61)
  Top 0.254: v116.94,36.84 116.94,31.13 118.84,31.13 IC23.25
  Bottom 0.254: IC22.25 80.11,30.49 81.38,31.76 95.35,31.76 96.62,30.49 97.89,30.49 IC29.25 100.43,30.49 101.7,31.76 116.94,31.76 118.21,30.49 IC23.25 | v116.94,36.84 116.94,41.29 115.67,42.56 115.67,47 112.49,50.18 103.6,50.18 102.33,48.91 IC17.16
A09  (via drill 0.61)
  Top 0.254: v108.68,42.56 v106.78,44.46
  Bottom 0.254: IC22.24 80.11,27.95 81.38,29.22 96.62,29.22 97.89,27.95 IC29.24 100.43,27.95 101.7,29.22 116.94,29.22 118.21,27.95 IC23.24 120.11,28.59 121.38,28.59 121.38,33.67 120.75,34.3 108.68,34.3 v108.68,42.56 | v106.78,44.46 104.24,47 IC17.17
A10
  Top 0.254: IC17.18 106.78,47 104.24,44.46 99.79,44.46 97.25,41.92 97.25,20.97 98.52,20.97 IC29.21
  Bottom 0.254: IC22.21 80.11,20.33 81.38,21.6 85.82,21.6 87.09,20.33 97.89,20.33 IC29.21 100.43,20.33 101.7,21.6 116.94,21.6 118.21,20.33 IC23.21
A11  (via drill 0.61)
  Top 0.254: v113.76,47 113.13,46.37 111.22,46.37 109.95,47.64 IC17.19 | v115.67,36.84 115.67,26.05 118.84,26.05 IC23.23
  Bottom 0.254: IC22.23 80.11,25.41 81.38,26.68 95.35,26.68 96.62,25.41 97.89,25.41 IC29.23 100.43,25.41 101.7,26.68 116.94,26.68 118.21,25.41 IC23.23 | v113.76,47 113.76,41.92 115.03,41.92 115.67,41.29 v115.67,36.84
A12  (via drill 0.61)
  Top 0.254: IC22.2 64.87,35.57 65.5,36.21 76.93,36.21 77.57,36.84 81.38,36.84 82.65,35.57 IC29.2 85.19,35.57 87.09,37.48 v93.44,37.48
  Bottom 0.254: IC17.20 111.22,47.64 107.41,43.83 107.41,38.75 104.87,36.21 IC23.2 102.97,35.57 101.7,35.57 100.43,34.3 96.62,34.3 v93.44,37.48
A13  (via drill 0.61)
  Top 0.254: v61.69,13.98 40.74,13.98 39.47,15.25 IC19.4 | v99.16,50.81 98.52,50.18 93.44,50.18 92.81,49.54 92.81,45.1 90.27,45.1 90.27,38.75 v89,38.75
  Bottom 0.254: v61.69,13.98 64.87,13.98 73.76,22.87 73.76,32.4 78.2,32.4 IC22.26 79.47,33.67 82.65,36.84 90.9,36.84 | IC23.26 118.21,33.03 108.68,33.03 107.41,34.3 101.7,34.3 100.43,33.03 IC29.26 97.89,33.03 94.71,33.03 90.9,36.84 | v99.16,50.81 106.78,50.81 106.78,59.7 108.05,60.97 109.32,60.97 111.22,62.88 IC17.21 | 90.9,36.84 v89,38.75
A14  (via drill 0.61)
  Top 0.254: v66.14,27.95 66.77,28.59 76.93,28.59 77.57,29.22 88.36,29.22 96.62,37.48 96.62,44.46 v97.25,44.46
  Bottom 0.254: v66.14,27.95 66.14,25.41 64.87,24.14 62.33,24.14 59.79,21.6 53.44,21.6 52.17,20.33 IC28.2 | v97.25,44.46 97.25,46.37 97.89,47 97.89,52.08 101.06,52.08 106.14,57.16 106.14,61.61 107.41,61.61 108.68,62.88 IC17.22
A15  (via drill 0.61)
  Top 0.254: v74.39,38.11 76.3,38.11 77.57,39.38 80.11,39.38 82.65,36.84 85.19,36.84 89,40.65 89,41.92 EP2.3 | v102.97,56.53 96.62,56.53 v90.9,50.81
  Bottom 0.254: v74.39,38.11 71.85,35.57 71.22,35.57 71.22,22.87 64.87,16.52 53.44,16.52 52.17,17.79 IC28.3 | v102.97,56.53 102.97,59.7 106.14,62.88 IC17.23 | v90.9,50.81 90.9,50.18 90.27,49.54 90.27,44.46 89,44.46 EP2.3
CB1
  Top 0.254: R14.1 12.8,23.51 12.8,24.14 JP3.2 12.8,26.68 17.88,26.68 17.88,30.49 19.78,32.4 IC24.18
D0  (via drill 0.61)
  Top 0.254: IC22.11 64.87,12.71 66.14,11.44 81.38,11.44 82.65,12.71 IC29.11 | IC21.22 54.71,55.89 53.44,57.16 38.2,57.16 36.93,58.43 IC24.33 | v75.03,30.49 73.76,31.76 v66.14,31.76
  Bottom 0.254: IC23.11 102.97,12.71 101.7,11.44 87.09,11.44 85.82,12.71 85.19,12.71 IC29.11 | 72.49,53.35 59.79,53.35 57.25,55.89 IC21.22 | 72.49,53.35 75.03,53.35 75.03,58.43 77.57,60.97 80.11,60.97 80.11,64.78 80.74,65.42 84.55,65.42 85.82,64.15 IC17.31 | v75.03,30.49 75.03,22.87 64.87,12.71 IC22.11 | v66.14,31.76 66.14,40.65 68.04,40.65 72.49,45.1 72.49,53.35
D1  (via drill 0.61)
  Top 0.254: IC22.12 64.87,10.17 66.14,8.9 80.11,8.9 81.38,10.17 82.65,10.17 IC29.12 85.19,10.17 86.46,11.44 101.7,11.44 102.97,10.17 IC23.12 | v45.18,54.62 v53.44,54.62 | v89,59.7 87.73,58.43 78.84,58.43 77.57,57.16 61.06,57.16 57.25,53.35 IC21.21 | v29.31,50.81 34.39,55.89 IC24.32
  Bottom 0.254: v45.18,54.62 38.2,54.62 36.93,55.89 IC24.32 | v53.44,54.62 54.71,53.35 IC21.21 | v89,59.7 89,62.24 IC17.30 | v29.31,50.81 31.85,48.27 32.48,48.27 32.48,10.81 36.93,6.36 39.47,6.36 42.01,3.82 47.09,3.82 49.63,6.36 52.17,6.36 54.71,8.9 61.06,8.9 62.33,10.17 IC22.12
D2
  Top 0.254: 81.38,6.36 66.14,6.36 64.87,7.63 IC22.13 62.33,7.63 61.06,8.9 42.01,8.9 39.47,11.44 36.93,11.44 35.66,12.71 35.66,21.6 40.74,21.6 42.01,20.33 43.28,20.33 44.55,21.6 47.09,21.6 47.72,22.24 47.72,26.68 47.09,27.32 47.09,29.22 52.17,29.22 54.07,31.13 54.07,41.92 57.25,41.92 57.88,42.56 57.88,50.18 56.61,50.18 IC21.20 54.71,50.81 53.44,52.08 52.17,52.08 | 81.38,6.36 82.65,7.63 IC29.13 | 81.38,6.36 101.7,6.36 102.97,7.63 IC23.13 | 52.17,52.08 38.2,52.08 36.93,53.35 IC24.31 | 52.17,52.08 54.71,54.62 57.25,54.62 60.42,57.8 76.93,57.8 78.2,59.07 87.09,59.07 90.9,62.88 IC17.29
D3  (via drill 0.61)
  Top 0.254: IC21.19 54.71,48.27 53.44,49.54 38.2,49.54 36.93,50.81 IC24.30 | v38.83,66.69 36.93,64.78 34.39,64.78 33.75,64.15 33.75,57.16 36.93,57.16 37.56,56.53 37.56,54.62 34.39,54.62 33.75,53.99 33.75,51.45 35.02,51.45 IC24.30 | v29.31,13.98 36.93,6.36 64.87,6.36 65.5,5.73 76.93,5.73 77.57,5.09 IC22.15 | v29.31,48.27 31.85,50.81 34.39,50.81 IC24.30
  Bottom 0.254: 96.62,6.36 81.38,6.36 80.11,5.09 IC22.15 | 96.62,6.36 97.89,5.09 IC29.15 | 96.62,6.36 116.94,6.36 118.21,5.09 IC23.15 | v38.83,66.69 43.91,66.69 43.91,81.29 47.72,85.1 64.23,85.1 64.23,83.2 69.31,78.12 77.57,78.12 77.57,70.5 81.38,66.69 90.9,66.69 93.44,64.15 IC17.28 | v29.31,13.98 v29.31,48.27
D4  (via drill 0.61)
  Top 0.254: IC21.18 54.71,45.73 53.44,47 38.2,47 36.93,48.27 IC24.29 34.39,48.27 v30.58,48.27 | IC22.16 80.11,7.63 81.38,8.9 96.62,8.9 97.89,7.63 IC29.16 | v93.44,66.69 102.97,66.69 102.97,69.86 v114.4,69.86
  Bottom 0.254: v114.4,69.86 116.94,67.32 118.21,67.32 122.02,63.51 122.02,47 123.92,47 125.19,45.73 125.19,8.9 | 125.19,8.9 125.19,8.27 120.11,8.27 IC23.16 | IC17.27 95.98,64.15 v93.44,66.69 92.81,67.32 82.65,67.32 82.65,82.56 78.84,86.37 41.37,86.37 38.83,83.83 10.89,83.83 8.99,81.93 1.37,81.93 1.37,60.34 2,59.7 8.99,59.7 11.53,57.16 21.69,57.16 v30.58,48.27 | 125.19,8.9 101.7,8.9 100.43,7.63 IC29.16
D5  (via drill 0.61)
  Top 0.254: IC21.17 54.71,43.19 53.44,44.46 36.93,44.46 36.29,45.1 IC24.28 | v60.42,43.83 59.79,43.83 59.79,48.27 68.04,56.53 78.2,56.53 79.47,57.8 93.44,57.8 98.52,62.88 IC17.26 | v111.22,57.16 110.59,57.8 v100.43,57.8
  Bottom 0.254: IC22.17 80.11,10.17 81.38,8.9 96.62,8.9 97.89,10.17 IC29.17 100.43,10.17 101.7,10.17 102.97,11.44 116.94,11.44 118.21,10.17 IC23.17 120.11,10.81 123.92,14.62 123.92,44.46 122.65,44.46 121.38,45.73 121.38,57.16 v111.22,57.16 | v60.42,43.83 59.79,43.19 57.25,43.19 IC21.17 | v100.43,57.8 100.43,62.24 99.16,62.24 IC17.26
D6  (via drill 0.61)
  Top 0.254: IC22.18 80.11,12.71 81.38,13.98 95.35,13.98 96.62,12.71 97.89,12.71 IC29.18 | v102.97,55.26 104.24,53.99 115.03,53.99 115.67,54.62 119.48,54.62 120.75,53.35 120.75,42.56 123.92,39.38 123.92,15.89 120.75,12.71 IC23.18 | v31.21,38.75 35.02,42.56 IC24.27
  Bottom 0.254: IC24.27 36.93,43.19 38.2,41.92 53.44,41.92 54.71,40.65 IC21.16 | v102.97,55.26 101.7,55.26 101.7,62.24 IC17.25 | IC29.18 100.43,12.71 101.7,13.98 116.94,13.98 118.21,12.71 IC23.18 | v31.21,38.75 31.21,11.44 31.85,10.81 31.85,2.55 67.41,2.55 77.57,12.71 IC22.18
D7  (via drill 0.61)
  Top 0.254: v61.69,43.83 62.33,43.83 62.33,49.54 68.68,55.89 78.84,55.89 80.11,57.16 97.89,57.16 103.6,62.88 IC17.24 104.24,62.24 108.05,58.43 112.49,58.43 v112.49,55.26
  Bottom 0.254: IC22.19 80.11,15.25 81.38,13.98 96.62,13.98 97.89,15.25 IC29.19 100.43,15.25 101.7,16.52 105.51,16.52 106.78,15.25 118.21,15.25 IC23.19 120.11,15.89 123.29,19.06 123.29,41.92 121.38,41.92 120.75,42.56 120.75,52.08 115.67,52.08 v112.49,55.26 | IC24.26 36.93,40.65 38.2,39.38 53.44,39.38 54.71,38.11 IC21.15 56.61,38.75 v61.69,43.83
E  (via drill 0.61)
  Top 0.254: IC18.9 123.92,53.99 123.92,55.26 IC18.10 123.29,55.89 v120.75,58.43 | v108.05,59.7 105.51,62.24 105.51,65.42 80.74,65.42 79.47,64.15 IC17.34 | v30.58,71.13 34.39,74.94 47.72,74.94 51.53,78.75 52.17,78.75 IC2.3
  Bottom 0.254: IC21.14 54.71,35.57 53.44,36.84 36.93,36.84 36.29,37.48 IC24.25 35.02,38.75 33.12,40.65 33.12,48.91 30.58,51.45 v30.58,71.13 | 58.52,73.67 60.42,71.77 IC2.9 | 58.52,73.67 54.07,78.12 IC2.3 | 58.52,73.67 54.71,69.86 51.53,69.86 51.53,66.05 52.8,64.78 55.98,64.78 59.79,60.97 76.3,60.97 78.2,62.88 IC17.34 | v120.75,58.43 119.48,59.7 v108.05,59.7
EP
  Top 0.254: IC28.4 52.17,15.25 57.25,15.25 IC28.13
GND  (via drill 0.61)
  Top 0.508: JP3.1 9.62,26.05 8.35,27.32 IC26.10 8.35,28.59 13.43,33.67 13.43,48.27 14.07,48.27 IC26.19 14.7,48.91 14.07,48.91 10.26,52.72 BYP26.2 10.26,53.99 8.99,55.26 8.35,55.26 IC25.10 | 17.88,1.28 14.07,5.09 IC27.7 | 17.88,1.28 26.13,1.28 27.4,2.55 C.2 28.04,3.19 28.04,4.46 C6.2 | 17.88,1.28 10.89,1.28 5.18,7 C7.2 | C6.2 28.67,5.09 36.93,5.09 IC19.8 39.47,5.09 40.74,3.82 48.36,3.82 | C6.2 28.04,5.73 28.04,7 C4.2 28.04,8.27 28.04,9.54 C5.2 | 48.36,3.82 49.63,5.09 IC28.8 | 61.06,3.82 62.33,5.09 IC22.14 | 48.36,3.82 61.06,3.82 | 81.38,3.82 82.65,5.09 IC29.14 | 61.06,3.82 81.38,3.82 | 81.38,3.82 101.7,3.82 102.97,5.09 IC23.14 | 64.23,74.31 64.87,73.67 65.5,73.67 BYP20.2 | 64.23,74.31 62.33,76.21 IC2.11 61.69,76.85 62.96,78.12 62.96,80.02 57.25,80.02 54.71,77.48 51.53,77.48 42.64,68.59 41.37,68.59 QG1.7 40.74,67.96 40.74,66.05 | 64.23,74.31 70.58,80.66 IC20.15 71.85,81.93 73.12,83.2 82.01,83.2 83.28,81.93 IC20.10 | BYP23.2 99.79,45.73 100.43,45.73 EP-1.1 102.33,46.37 102.97,47 102.97,50.18 | BYP18.2 115.03,50.81 115.67,50.81 IC18.7 116.94,50.18 116.94,48.27 JP1.1 116.94,45.73 114.4,45.73 | 114.4,45.73 114.4,41.29 BYP29.2 | 102.97,50.18 107.41,50.18 108.05,49.54 108.05,45.73 114.4,45.73 | COM.5 109.95,71.77 114.4,71.77 COM.G2 118.21,74.31 122.02,78.12 C3.2 | 102.97,50.18 101.06,52.08 v95.35,52.08 | v47.09,60.97 42.01,60.97 IC21.1 40.74,61.61 40.74,62.88 BYP21.2 40.74,64.15 40.74,66.05 | 40.74,66.05 52.8,66.05 BYP2.2 | IC25.19 16.61,76.21 19.15,76.21 IC24.1 20.42,76.85 20.42,78.12 BYP24.2 | BYP25.2 10.26,80.66 14.07,76.85 14.7,76.85 IC25.19 | IC28.1 51.53,23.51 52.8,24.78 53.44,24.78 BYP28.2 53.44,26.05 53.44,27.95 55.34,27.95 59.79,32.4 59.79,42.56 63.6,42.56 BYP17.2 63.6,43.83 63.6,47 IC17.1
  Top 0.508: v66.77,41.92 71.85,41.92 73.12,40.65 BYP22.2 | IC25.10 6.45,55.89 5.81,55.89 CORE-IO.10 | v26.77,29.22 38.83,29.22 40.1,27.95 R13.1 40.74,27.32 40.74,26.05 BYP19.2 40.74,24.78 43.28,24.78 v43.28,21.6 | IC25.19 14.7,75.58 10.26,71.13 10.26,56.53 8.35,56.53 IC25.10
  Bottom 0.508: JP3.1 10.26,24.14 3.91,17.79 3.91,8.27 5.18,8.27 C7.2 | 69.95,67.32 66.77,64.15 IC17.39 | 69.95,67.32 74.39,67.32 75.66,68.59 C11.2 | 69.95,67.32 69.95,75.58 67.41,75.58 66.14,74.31 BYP20.2 | IC20.10 83.92,80.02 89.63,74.31 90.27,74.31 COM.G1 91.54,70.5 95.98,66.05 97.89,66.05 | 97.89,66.05 99.16,67.32 RS-232.2 | 97.89,66.05 104.87,66.05 109.32,70.5 COM.5 | v95.35,52.08 95.35,53.99 97.25,53.99 97.89,54.62 97.89,66.05 | v47.09,60.97 52.17,60.97 54.71,58.43 IC21.23 | 10.26,72.4 6.45,72.4 5.18,71.13 JP4.1 | 10.26,72.4 14.07,76.21 IC25.19 | 10.26,72.4 37.56,72.4 40.74,69.23 QG1.7 | v66.77,41.92 65.5,43.19 64.23,43.19 BYP17.2 | CORE-IO.11 3.27,53.35 5.18,55.26 CORE-IO.10 | 25.5,30.49 21.69,26.68 17.24,26.68 15.97,25.41 BYP27.2 | 25.5,30.49 25.5,47 17.88,47 16.61,48.27 IC26.19 | 25.5,30.49 v26.77,29.22 | v43.28,21.6 48.36,21.6 49.63,22.87 IC28.1
N$1
  Bottom 0.254: COM.6 100.43,73.04 101.06,72.4 106.14,72.4 106.78,71.77 COM.4
N$2
  Top 0.254: QG1.8 48.36,69.23 52.17,73.04 52.8,73.04 IC2.5
  Bottom 0.254: IC2.1 52.8,83.2 51.53,81.93 51.53,74.31 52.8,74.31 IC2.5
N$3
  Bottom 0.254: IC2.10 61.69,74.31 62.96,75.58 62.96,80.66 61.69,80.66 IC2.13
N$4  (via drill 0.61)
  Top 0.254: v109.95,39.38 106.14,43.19 102.97,43.19 EP-1.2
  Bottom 0.254: v109.95,39.38 113.76,35.57 118.21,35.57 IC23.27
N$5
  Top 0.254: IC25.18 16.61,73.67 19.15,73.67 IC24.2
N$6
  Top 0.254: IC18.5 116.3,56.53 116.3,57.8 IC18.4 116.3,59.07 116.3,60.34 IC18.3
N$7
  Bottom 0.254: IC2.8 61.69,69.23 63.6,71.13 63.6,83.2 61.69,83.2 IC2.14
N$21
  Top 0.254: 116.3,68.59 121.38,68.59 C3.1 | 116.3,68.59 112.49,68.59 R1.1 | 116.3,68.59 116.3,66.69 IC18.1
N$22  (via drill 0.61)
  Top 0.254: v119.48,53.35 119.48,48.27 JP1.2 | v119.48,55.89 119.48,62.88 117.57,62.88 IC18.2
  Bottom 0.254: IC18.2 116.3,64.15 115.03,65.42 114.4,65.42 R2.1 | v119.48,53.35 v119.48,55.89
N$23  (via drill 0.61)
  Top 0.254: v28.04,48.27 31.85,52.08 v32.48,52.08 | IC21.3 40.1,55.26 40.1,53.99 IC21.4
  Bottom 0.254: v28.04,48.27 28.04,27.95 24.23,24.14 18.51,24.14 18.51,15.89 13.43,10.81 IC27.5 | v32.48,52.08 38.2,52.08 39.47,53.35 IC21.4
N$24
  Top 0.254: IC26.18 15.97,46.37 17.24,47.64 17.24,53.35 19.15,53.35 IC24.10
N$25
  Top 0.254: IC26.17 15.97,43.83 17.88,45.73 17.88,50.81 19.15,50.81 IC24.11
N$27
  Top 0.254: IC27.2 11.53,17.79 10.89,17.79 R11.A | C.1 22.96,3.19 22.96,4.46 C6.1 | IC27.6 11.53,7.63 9.62,9.54 8.35,9.54 R11.S
  Bottom 0.254: C6.1 22.96,5.73 22.32,6.36 15.34,6.36 14.07,7.63 IC27.6 | R11.A 10.26,16.52 10.26,11.44 7.72,11.44 R11.S
N$28
  Bottom 0.254: R9.1 29.94,2.55 28.67,3.82 22.32,3.82 21.05,2.55 R10.2 19.78,2.55 18.51,1.28 10.89,1.28 7.72,4.46 6.45,4.46 6.45,17.16 8.99,19.7 10.89,19.7 11.53,20.33 IC27.1
N$94
  Top 0.254: IC26.16 15.97,41.29 18.51,43.83 18.51,48.27 19.15,48.27 IC24.12
N$124
  Bottom 0.254: IC26.15 15.97,38.75 17.88,40.65 17.88,45.73 19.15,45.73 IC24.13
N$125
  Bottom 0.254: IC26.14 15.97,36.21 18.51,38.75 18.51,43.19 19.15,43.19 IC24.14
N$126
  Top 0.254: IC26.13 15.97,33.67 17.24,34.94 17.24,40.65 19.15,40.65 IC24.15
N$127
  Top 0.254: IC26.12 15.97,31.13 17.88,33.03 17.88,38.11 19.15,38.11 IC24.16
N$128
  Top 0.254: IC26.11 15.97,28.59 17.24,29.86 17.24,31.13 18.51,32.4 18.51,35.57 19.15,35.57 IC24.17
N$129
  Top 0.254: IC25.17 16.61,71.13 19.15,71.13 IC24.3
N$130
  Top 0.254: IC25.16 16.61,68.59 19.15,68.59 IC24.4
N$131
  Top 0.254: IC25.15 16.61,66.05 19.15,66.05 IC24.5
N$132
  Top 0.254: IC25.14 16.61,63.51 19.15,63.51 IC24.6
N$133
  Top 0.254: IC25.13 16.61,60.97 19.15,60.97 IC24.7
N$134
  Top 0.254: IC25.12 16.61,58.43 19.15,58.43 IC24.8
N$135
  Top 0.254: IC25.11 16.61,55.89 19.15,55.89 IC24.9
N$136
  Bottom 0.254: IC24.19 19.78,31.13 16.61,34.3 14.07,34.3 10.26,38.11 10.26,50.18 8.35,50.18 IC26.1
N$137
  Bottom 0.254: IC25.1 8.99,78.75 10.26,80.02 16.61,80.02 18.51,78.12 18.51,74.94 33.12,74.94 34.39,73.67 IC24.39
N$138  (via drill 0.61)
  Top 0.254: v24.23,31.76 24.23,56.53 28.04,56.53 29.31,57.8 29.31,76.21 34.39,76.21 IC24.40
  Bottom 0.254: v24.23,31.76 21.69,29.22 11.53,29.22 11.53,22.24 12.16,21.6 14.7,21.6 14.7,14.62 14.07,13.98 10.89,13.98 10.89,9.54 11.53,8.9 17.88,8.9 19.15,7.63 IC27.9
N$140
  Top 0.254: IC27.8 21.05,5.73 22.32,7 22.96,7 C4.1 23.59,7.63 25.5,9.54 R4.1
  Bottom 0.254: IC27.12 21.05,14.62 24.86,10.81 25.5,10.81 R4.1
N$141
  Top 0.254: IC27.13 21.69,17.79 22.32,17.79 R3.1 23.59,17.79 24.86,17.79 R4.2
N$142
  Top 0.254: IC27.11 21.69,12.71 24.23,15.25 27.4,15.25 C5.1
N$143
  Top 0.254: R10.1 12.16,2.55 10.89,3.82 10.26,3.82 R11.E
N$145
  Top 0.254: COM.7 103.6,73.67 104.87,73.67 COM.8
N$147  (via drill 0.61)
  Top 0.254: v51.53,63.51 52.17,64.15 59.15,64.15 67.41,72.4 67.41,75.58 93.44,75.58 v94.08,74.94 | IC18.12 123.92,61.61 123.92,62.88 IC18.13
  Bottom 0.254: v51.53,63.51 50.26,62.24 45.82,62.24 45.82,55.89 46.45,55.26 46.45,54.62 45.18,53.35 44.55,53.35 42.01,50.81 IC21.5 | v94.08,74.94 96.62,77.48 116.3,77.48 123.29,70.5 123.29,67.32 122.65,66.69 122.65,64.15 123.92,64.15 IC18.13
N$148
  Bottom 0.254: LED1.K 123.29,48.91 123.29,49.54 122.65,50.18 122.65,58.43 123.29,58.43 IC18.11
N$149
  Top 0.254: R12.1 122.02,43.83 123.29,45.1 LED1.A
N$150  (via drill 0.61)
  Top 0.254: R13.2 48.99,27.95 49.63,27.95 JP2.1 51.53,28.59 54.07,28.59 57.88,32.4 58.52,32.4 58.52,48.27 61.06,50.81 v61.06,55.89
  Bottom 0.254: v61.06,55.89 56.61,60.34 IC21.24
N$151  (via drill 0.61)
  Top 0.254: v72.49,19.06 61.06,19.06 59.79,20.33 IC28.15 | v90.27,24.14 95.35,19.06 114.4,19.06 117.57,15.89 117.57,11.44 120.75,11.44 124.56,15.25 124.56,50.18 IC18.8
  Bottom 0.254: v72.49,19.06 77.57,24.14 v90.27,24.14
N$153
  Top 0.254: IC20.7 84.55,73.04 85.82,73.04 IC20.8
N$154
  Top 0.254: C7.1 5.81,12.71 8.35,15.25 11.53,15.25 IC27.3
N$155
  Top 0.254: C9.2 80.74,71.13 79.47,72.4 78.84,72.4 IC20.5
N$156
  Top 0.254: C9.1 76.3,71.77 76.3,72.4 IC20.4
N$157
  Top 0.254: C8.2 73.76,69.23 75.03,70.5 75.03,72.4 73.76,72.4 IC20.3
N$158
  Top 0.254: C8.1 68.68,69.23 69.95,70.5 69.95,72.4 68.68,72.4 IC20.1
N$159
  Top 0.254: C11.1 81.38,69.23 82.65,70.5 82.65,72.4 81.38,72.4 IC20.6
N$160
  Top 0.254: C10.2 73.12,71.13 71.85,72.4 71.22,72.4 IC20.2
P1
  Top 0.254: IC29.1 84.55,38.75 86.46,40.65 86.46,41.92 EP2.2
P27  (via drill 0.61)
  Top 0.254: v94.08,39.38 91.54,41.92 EP2.4
  Bottom 0.254: v94.08,39.38 97.89,35.57 IC29.27
PIA-A0
  Bottom 0.254: IC25.2 6.45,76.21 5.18,74.94 2.64,74.94 2,74.31 2,66.69 2.64,66.69 CORE-IO.1
PIA-A1
  Top 0.254: IC25.3 7.08,73.04 5.81,71.77 5.81,66.69 5.18,66.69 CORE-IO.2
PIA-A2
  Bottom 0.254: IC25.4 7.08,70.5 3.91,67.32 3.91,65.42 2.64,64.15 CORE-IO.3
PIA-A3
  Top 0.254: IC25.5 8.35,67.96 9.62,66.69 9.62,64.78 5.81,64.78 5.18,64.15 CORE-IO.4
PIA-A4
  Bottom 0.254: IC25.6 8.35,65.42 9.62,64.15 9.62,62.24 4.54,62.24 3.27,60.97 CORE-IO.5
PIA-A5
  Top 0.254: IC25.7 7.08,62.88 5.81,61.61 5.18,61.61 CORE-IO.6
PIA-A6
  Top 0.254: IC25.8 7.08,60.34 6.45,59.7 4.54,59.7 3.27,58.43 CORE-IO.7
PIA-A7
  Top 0.254: IC25.9 6.45,58.43 5.81,58.43 CORE-IO.8
PIA-B0
  Bottom 0.254: IC26.2 7.08,48.91 6.45,49.54 4.54,49.54 3.27,50.81 CORE-IO.13
PIA-B1
  Top 0.254: IC26.3 8.35,46.37 9.62,47.64 9.62,49.54 5.81,49.54 5.18,50.18 CORE-IO.14
PIA-B2
  Top 0.254: IC26.4 7.08,43.83 6.45,44.46 4.54,44.46 3.91,45.1 3.91,47.64 2.64,47.64 CORE-IO.15
PIA-B3
  Bottom 0.254: IC26.5 8.35,41.29 9.62,42.56 9.62,47 5.81,47 5.18,47.64 CORE-IO.16
PIA-B4
  Top 0.254: IC26.6 7.08,38.75 3.91,41.92 3.91,43.83 2.64,45.1 CORE-IO.17
PIA-B5
  Bottom 0.254: IC26.7 7.08,36.21 3.91,39.38 3.91,45.73 4.54,45.73 CORE-IO.18
PIA-B6
  Top 0.254: IC26.8 7.08,33.67 2.64,38.11 2.64,42.56 CORE-IO.19
PIA-B7
  Top 0.254: IC26.9 8.35,31.13 9.62,32.4 9.62,41.92 5.81,41.92 5.18,42.56 CORE-IO.20
Q  (via drill 0.61)
  Top 0.254: v56.61,70.5 56.61,74.31 60.42,78.12 IC2.12
  Bottom 0.254: IC17.35 75.66,62.88 74.39,61.61 60.42,61.61 54.07,67.96 IC2.7 54.71,68.59 v56.61,70.5
R/!W  (via drill 0.61)
  Top 0.254: v61.06,33.03 62.33,34.3 65.5,34.3 66.77,35.57 77.57,35.57 IC22.27
  Bottom 0.254: IC24.21 36.93,27.95 40.74,31.76 53.44,31.76 54.71,33.03 IC21.13 57.25,33.03 v61.06,33.03 | IC22.27 78.2,36.21 76.93,37.48 76.93,41.92 82.01,41.92 82.65,41.29 93.44,41.29 94.08,41.92 EP2.5 94.08,44.46 92.81,44.46 92.81,53.35 83.92,62.24 IC17.32
RX  (via drill 0.61)
  Top 0.254: v44.55,59.07 45.18,59.7 75.03,59.7 77.57,62.24 77.57,71.13 v78.84,71.13
  Bottom 0.254: v44.55,59.07 42.64,59.07 42.01,58.43 IC21.2 | v78.84,71.13 80.11,72.4 80.11,80.02 78.84,80.02 IC20.12
RXD
  Top 0.254: 96.62,72.4 96.62,69.86 RS-232.3 | 96.62,72.4 96.62,73.67 94.08,76.21 80.11,76.21 76.3,80.02 IC20.13 | 96.62,72.4 102.33,72.4 103.6,71.13 COM.3
TX
  Bottom 0.254: IC21.6 39.47,48.27 38.2,49.54 33.75,49.54 31.21,52.08 31.21,69.86 37.56,69.86 40.1,67.32 41.37,67.32 43.28,69.23 43.28,85.74 76.93,85.74 80.74,81.93 IC20.11
TXD  (via drill 0.61)
  Top 0.254: v78.84,78.75 80.74,76.85 94.71,76.85 v97.89,73.67 | RS-232.1 101.7,69.86 101.7,70.5 COM.2
  Bottom 0.254: v78.84,78.75 76.3,78.75 74.39,80.66 IC20.14 | v97.89,73.67 99.16,72.4 99.79,72.4 100.43,71.77 101.06,71.77 COM.2
VCC  (via drill 0.61)
  Top 0.508: EP2.1 83.28,42.56 81.38,40.65 79.47,40.65 BYP22.1 | IC23.28 119.48,38.75 119.48,40.02 BYP29.1 | R12.2 122.02,36.21 120.75,37.48 120.11,37.48 IC23.28 | IC29.28 99.16,38.75 99.16,40.02 BYP23.1 99.79,40.65 100.43,40.65 EP-1.3 102.33,40.02 103.6,38.75 IC23.1 105.51,38.11 118.21,38.11 IC23.28 | 15.34,11.44 16.61,10.17 19.15,10.17 IC27.10 21.69,10.17 22.32,10.17 R3.2 | 15.34,11.44 14.07,12.71 IC27.4 | 15.34,11.44 18.51,11.44 | 18.51,11.44 28.67,11.44 29.94,10.17 R9.2 | 18.51,20.97 19.15,20.33 IC27.14 20.42,20.97 20.42,24.78 BYP27.1 20.42,26.05 20.42,27.32 IC24.20 21.69,27.95 24.23,30.49 34.39,30.49 IC24.22 36.93,30.49 39.47,33.03 IC21.12 42.01,33.03 45.82,33.03 | 18.51,20.97 17.88,21.6 7.08,21.6 5.81,22.87 R14.2 | 18.51,11.44 18.51,20.97 | IC17.7 78.84,47 78.84,46.37 R8.2 78.2,45.73 75.66,43.19 69.31,43.19 BYP17.1 68.04,43.19 65.5,43.19 65.5,41.29 69.95,36.84 76.3,36.84 77.57,38.11 IC22.28 | IC24.24 36.29,36.21 37.56,37.48 38.2,37.48 R7.2 | IC21.10 39.47,38.11 38.83,38.11 R7.2 | IC21.8 40.1,42.56 38.2,40.65 38.2,38.75 R7.2 | IC28.16 58.52,23.51 58.52,24.78 BYP28.1 | IC19.16 45.82,23.51 45.82,24.78 BYP19.1 45.82,26.05 45.82,33.03 | 45.82,33.03 47.09,33.03 49.63,30.49 JP2.2 | IC26.20 15.34,51.45 15.34,52.72 BYP26.1 | CORE-IO.12 4.54,53.35 2.64,55.26 CORE-IO.9 2.64,56.53 1.37,57.8 1.37,73.67 2.64,73.67 JP4.2 | IC25.20 15.34,79.39 15.34,80.66 BYP25.1 15.97,81.29 22.32,81.29 24.86,78.75 BYP24.1 26.13,78.75 29.94,82.56 50.26,82.56 | R1.2 104.24,67.96 106.14,66.05 R2.2 107.41,66.05 111.86,66.05 113.13,64.78 114.4,64.78 | 114.4,64.78 v114.4,58.43 114.4,56.53 BYP18.1
  Top 0.508: 114.4,64.78 122.02,64.78 123.29,66.05 IC18.14 123.92,66.69 123.92,81.93 88.36,81.93 85.82,84.47 71.85,84.47 69.31,81.93 IC20.16 68.04,81.93 67.41,82.56 50.26,82.56 | 50.26,82.56 51.53,81.29 52.17,81.29 IC2.2 | 50.26,82.56 48.99,83.83 QG1.14 | 66.77,68.59 68.68,70.5 C10.1 | 66.77,68.59 BYP20.1 66.77,68.59 | 66.77,68.59 68.04,67.32 69.31,67.32 70.58,66.05 R5.2 | BYP21.1 46.45,63.51 47.72,64.78 56.61,64.78 57.88,66.05 BYP2.1 58.52,66.69 57.88,66.69 54.07,70.5 IC2.6 54.07,71.77 55.34,71.77 55.34,74.31 54.07,75.58 IC2.4 | v115.03,48.91 114.4,49.54 113.76,49.54 v111.86,51.45
  Bottom 0.508: IC22.28 78.84,38.75 78.84,40.02 BYP22.1 79.47,40.65 98.52,40.65 BYP23.1 | BYP17.1 68.04,43.19 66.77,44.46 62.96,44.46 61.69,45.73 R6.2 60.42,45.73 59.15,44.46 43.28,44.46 42.01,43.19 IC21.8 | BYP28.1 57.88,25.41 52.8,30.49 52.17,30.49 JP2.2 | IC24.24 36.93,35.57 39.47,33.03 IC21.12 | IC26.20 14.07,50.81 12.8,52.08 7.08,52.08 5.81,53.35 CORE-IO.12 | JP4.2 5.18,73.67 6.45,74.94 10.26,74.94 14.07,78.75 IC25.20 | BYP20.1 65.5,68.59 64.23,67.32 60.42,67.32 59.15,66.05 BYP2.1 | QG1.14 48.36,83.2 48.36,71.77 52.8,71.77 IC2.6 | v115.03,48.91 115.67,49.54 118.21,49.54 118.21,45.1 118.84,44.46 119.48,44.46 119.48,41.29 BYP29.1 | v111.86,51.45 111.86,53.99 109.95,55.89 109.95,58.43 v114.4,58.43

### Text on the board
Top: Component Side
Bottom: PA8PDP/VRS | Solder side
tPlace: 1 | F09 | 2,54 | 6 | 9 | 1 | 5 | 1 | + | 1 | 1 | 20 | 27256 | 62256 | 1 | 3 | 1 | 2 | 3 | RealConsole CORE - Rev.1
tNames: IC2 | QG1 | IC25 | BYP25 | IC24 | BYP24 | IC20 | C9 | JP4 | C8 | BYP20 | C3 | R5 | RS-232 | R1 | IC18 | COM | R2 | IC21 | BYP18 | IC26 | BYP26 | IC17 | LED1 | R8 | R7 | R6 | BYP17 | R12 | BYP23 | IC22 | BYP22 | BYP29 | R13 | IC19 | IC28 | BYP27 | R14 | IC27 | R3 | R4 | R10 | R9
tValues: .01uf | 4Mhz | 74LS73N | .01uf | 74LS245N | MAX232 | + | 22uf | POWER | 6821 | 10K | - | .01uf | 0.1uf | 10K | 0.1uf | 3.3K | 74LS132N | 6850 | .01uf | .01uf | 6809E | 74LS245N | 3.3K | .01uf | 3.3K | 3.3K | LO/27256 | .01uf | .01uf | HI/27128 | 270 | .01uf | 6264A | .01uf | 1K | 3.3K | 74LS138N | 74LS139N | LM556N | 100K | 100K | 3.3K | 10K